# Altium project MyECG.PrjPcb
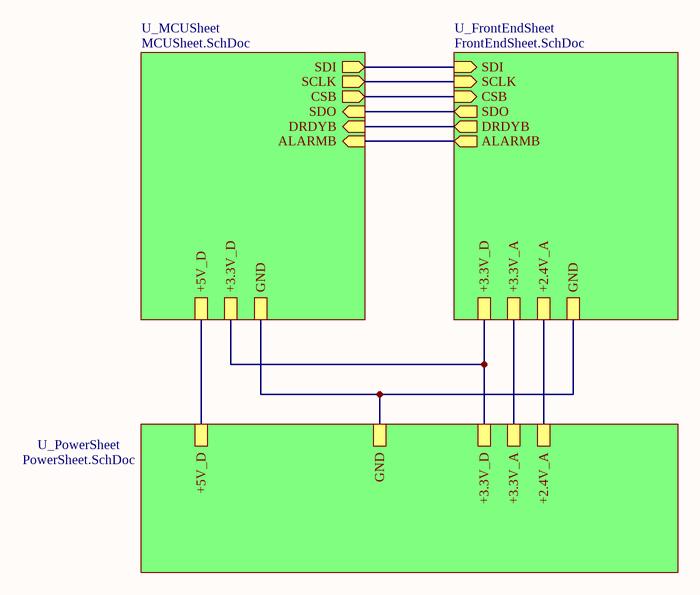
[diagram p0: MyECGSheet.SchDoc]
4 sheets, 152 parts. Net scope: hierarchical (ports join the sheet entries above them; power ports are global).
Board files: MyECGPCB_V1.2.9.PcbDoc, MyECGPCB_V1.2.9.1.PcbDoc
Sheets:
  MyECGSheet.SchDoc
    U_PowerSheet = PowerSheet.SchDoc
    U_FrontEndSheet = FrontEndSheet.SchDoc
    U_MCUSheet = MCUSheet.SchDoc

## Sheet MyECGSheet.SchDoc
size 203 x 152 mm

### Sub-sheets
U_FrontEndSheet = FrontEndSheet.SchDoc: DRDYB (out), SDO (out), SDI (in), SCLK (in), CSB (in), ALARMB (out), +3.3V_D, +3.3V_A, +2.4V_A, GND
U_MCUSheet = MCUSheet.SchDoc: +3.3V_D, GND, SDO (in), SDI (out), SCLK (out), CSB (out), DRDYB (in), ALARMB (in), +5V_D
U_PowerSheet = PowerSheet.SchDoc: GND, +5V_D, +3.3V_D, +3.3V_A, +2.4V_A

### Nets
+2.4V_A: sheet U_PowerSheet/+2.4V_A, sheet U_FrontEndSheet/+2.4V_A
+3.3V_A: sheet U_PowerSheet/+3.3V_A, sheet U_FrontEndSheet/+3.3V_A
+3.3V_D: sheet U_PowerSheet/+3.3V_D, sheet U_FrontEndSheet/+3.3V_D, sheet U_MCUSheet/+3.3V_D
BAT-: sheet U_PowerSheet/GND, sheet U_FrontEndSheet/GND, sheet U_MCUSheet/GND
V+: sheet U_PowerSheet/+5V_D, sheet U_MCUSheet/+5V_D
NetR2_2: sheet U_FrontEndSheet/DRDYB, sheet U_MCUSheet/DRDYB
NetR6_1: sheet U_FrontEndSheet/SDO, sheet U_MCUSheet/SDO
NetR11_1: sheet U_FrontEndSheet/ALARMB, sheet U_MCUSheet/ALARMB
NetT_P9_1: sheet U_FrontEndSheet/SDI, sheet U_MCUSheet/SDI
NetT_P11_1: sheet U_FrontEndSheet/CSB, sheet U_MCUSheet/CSB
NetT_P12_1: sheet U_FrontEndSheet/SCLK, sheet U_MCUSheet/SCLK

## Sheet PowerSheet.SchDoc
size 208 x 152 mm
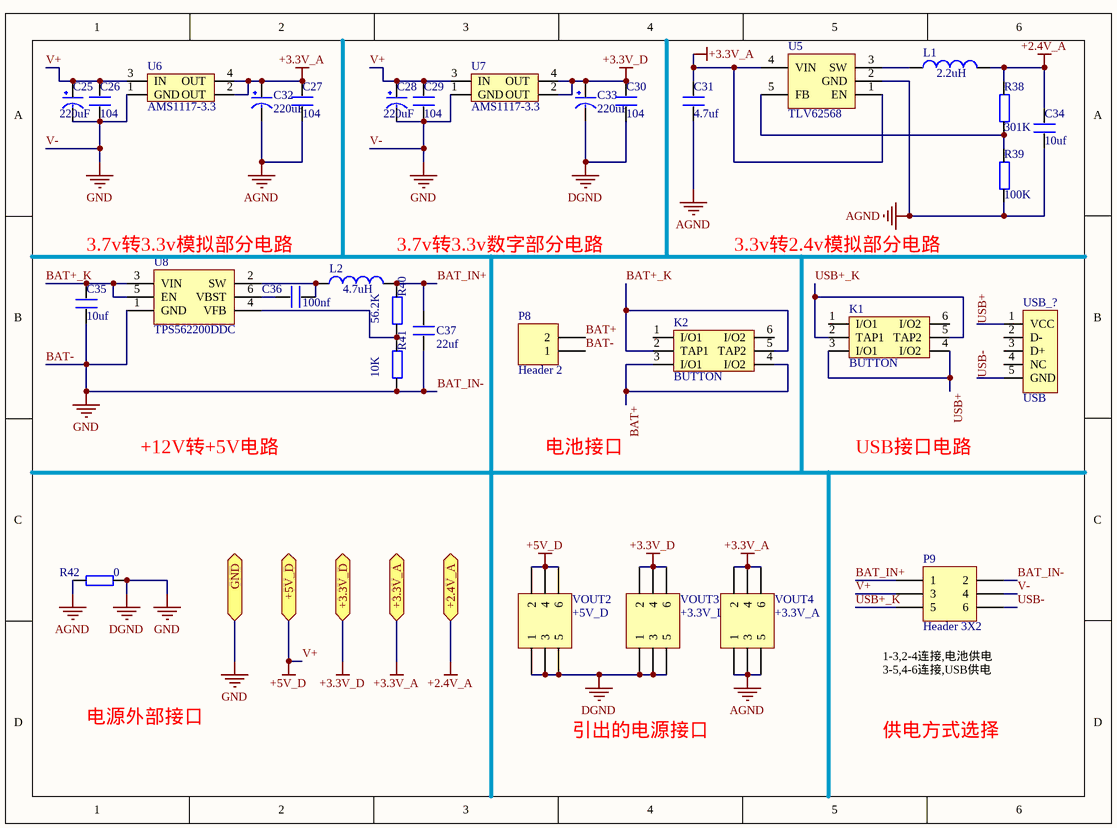
[diagram p1: PowerSheet.SchDoc]

### Parts
C25  220uF  [CC6.56.5]
C26  104  [0805]
C27  104  [0805]
C28  220uF  [CC6.56.5]
C29  104  [0805]
C30  104  [0805]
C31  4.7uf  [0805]
C32  220uF  [CC6.56.5]
C33  220uF  [CC6.56.5]
C34  10uf  [0805]
C35  10uf  [0805]
C36  100nf  [0805]
C37  22uf  [0805]
K1  BUTTON  [BTN8.5*8.5]
K2  BUTTON  [BTN8.5*8.5]
L1  value 2.2uH  [SDR0403]  (hidden comment: Inductor)
L2  value 4.7uH  [SDR0805]  (hidden comment: Inductor)
MINI_USB  USB  [USB/SM0.8-6H5]
P8  Header 2  [HDR1X2]
P9  Header 3X2  [HDR2X3]
R38  301K  [0805]
R39  100K  [0805]
R40  56.2K  [0805]
R41  10K  [0805]
R42  0  [0805]
U5  TLV62568  [LC-SOT-23-5]
U6  AMS1117-3.3  [AMS1117]
U7  AMS1117-3.3  [AMS1117]
U8  TPS562200DDC  [LC-SOT-23-6]
VOUT2  +5V_D  [HDR2X3]
VOUT3  +3.3V_D  [HDR2X3]
VOUT4  +3.3V_A  [HDR2X3]

### Ports
+2.4V_A, +3.3V_A, +3.3V_D, +5V_D, GND

### Nets
+2.4V_A: C34.2 L1.2 R38.2 ; port +2.4V_A
+3.3V_A: C27.2 C31.2 C32.1(VCC) U5.1(EN) U5.4(VIN) U6.2(OUT) U6.4(OUT) VOUT4.2 VOUT4.4 VOUT4.6 ; port +3.3V_A
+3.3V_D: C30.2 C33.1(VCC) U7.2(OUT) U7.4(OUT) VOUT3.2 VOUT3.4 VOUT3.6 ; port +3.3V_D
AGND: C27.1 C31.1 C32.2(GND) C34.1 R39.1 R42.1 U5.2(GND) VOUT4.1 VOUT4.3 VOUT4.5
BAT-: C25.2(GND) C26.1 C28.2(GND) C29.1 C30.1 C33.2(GND) C35.1 C37.2 P8.1 P9.2 P9.4 R41.1 R42.2 U6.1(GND) U7.1(GND) U8.1(GND) VOUT2.1 VOUT2.3 VOUT2.5 VOUT3.1 VOUT3.3 VOUT3.5 ; port GND  [also labelled BAT_IN-, DGND, GND, V-]
V+: C25.1(VCC) C26.2 C28.1(VCC) C29.2 P9.3 U6.3(IN) U7.3(IN) VOUT2.2 VOUT2.4 VOUT2.6 ; port +5V_D  [also labelled +5V_D]
BAT+: K2.3(I/O1) K2.4(I/O2) P8.2
BAT+_K: C35.2 K2.2(TAP1) K2.5(TAP2) U8.3(VIN) U8.5(EN)
BAT_IN+: C37.1 L2.2 P9.1 R40.2
USB+: K1.3(I/O1) K1.4(I/O2) MINI_USB.1(VCC)
USB+_K: K1.2(TAP1) K1.5(TAP2) P9.5
USB-: MINI_USB.5(GND) P9.6
NetC36_1: C36.1 L2.1 U8.2(SW)
NetC36_2: C36.2 U8.6(VBST)
NetL1_1: L1.1 U5.3(SW)
NetR38_1: R38.1 R39.2 U5.5(FB)
NetR40_1: R40.1 R41.2 U8.4(VFB)

Not connected (* = marked no-connect by the designer): K1 1(I/O1) 6(I/O2); K2 1(I/O1) 6(I/O2); MINI_USB 2(D-) 3(D+) 4(NC)

### Notes on the sheet
- 3.7v转3.3v模拟部分电路
- 3.7v转3.3v数字部分电路
- 3.3v转2.4v模拟部分电路
- +12V转+5V电路
- 电池接口
- USB接口电路
- (near P9) 1-3,2-4连接,电池供电
  3-5,4-6连接,USB供电
- 电源外部接口
- 引出的电源接口
- 供电方式选择

### Library data of the parts
C25 C28 C32 C33 = CAP
C26 C27 C29 C30 C35-C37 = C
C31 = C: Cap= 4.7 uF  ESR= 2.0 mOhm  VDC= 25.0 V  IRMS= 7.29 A
C34 = C: Cap= 10.0 uF  ESR= 2.0 mOhm  VDC= 6.3 V  IRMS= 0.0 A
L1 L2 = Inductor: L= 2.2 µH  DCR= 47.0 mOhm; Code_IEC: 1005; Published: 8-Jun-2000; LatestRevisionDate: 29-May-2009; LatestRevisionNote: IPC-7351 Footprint Added.; PackageReference: 0402-A; Publisher: Altium Limited; PackageDescription: Chip Inductor; Code_JEITA: 0402
MINI_USB = USB5
P8 = Header 2: Header, 2-Pin; LatestRevisionDate: 17-Jul-2002; LatestRevisionNote: Re-released for DXP Platform.; Publisher: Altium Limited
P9 VOUT2-VOUT4 = Header 3X2: Header, 3-Pin, Dual row; LatestRevisionDate: 17-Jul-2002; LatestRevisionNote: Re-released for DXP Platform.; Publisher: Altium Limited
R38 R40 R41 = R: Res= 100.0 kOhm  Power= 125.0 mW  Tolerance= 1.0%
R39 = R: Res= 301.0 kOhm  Power= 125.0 mW  Tolerance= 1.0%
R42 = R
U6 U7 = AMS1117

## Sheet FrontEndSheet.SchDoc
size 203 x 152 mm
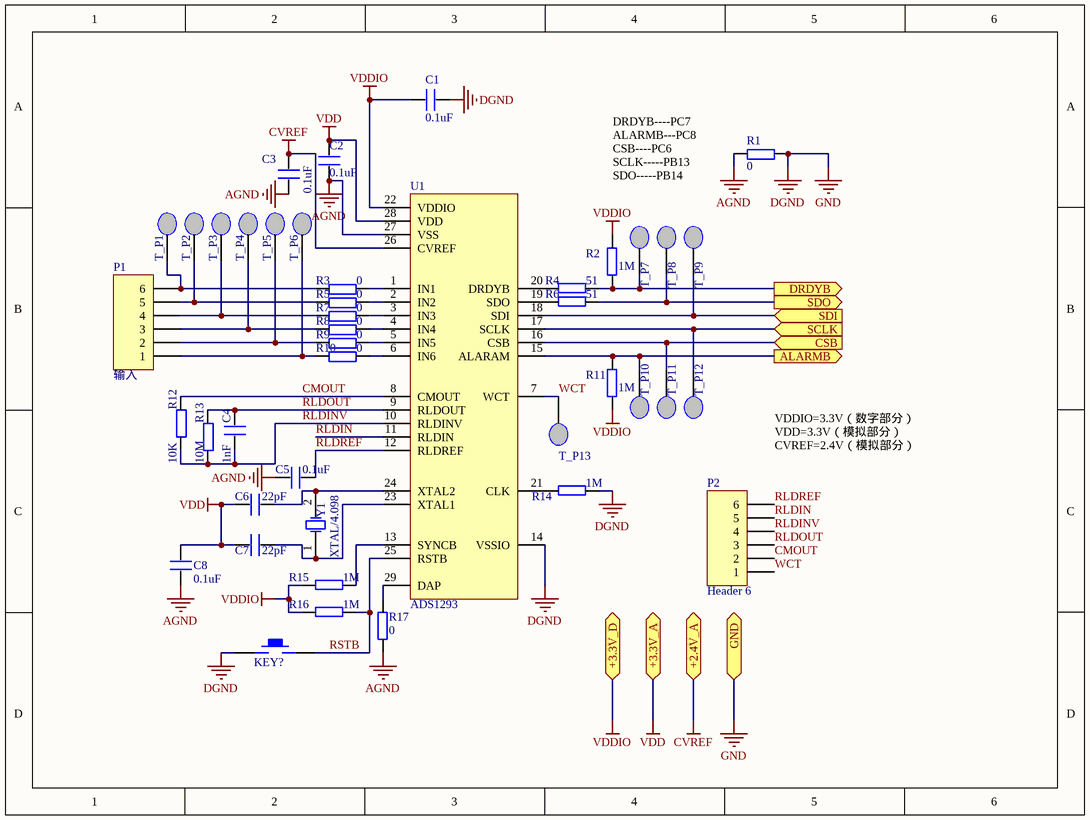
[diagram p2: FrontEndSheet.SchDoc]

### Parts
C1  0.1uF  [0805]
C2  0.1uF  [0805]
C3  0.1uF  [0805]
C4  1nF  [0603]
C5  0.1uF  [0805]
C6  22pF  [0805]
C7  22pF  [0805]
C8  0.1uF  [0805]
KEY_RESET  KEY_M  [KEY_M]  (value not drawn)
P1  输入  [HDR1X6]
P2  Header 6  [HDR1X6]
R1  0  [0805]
R2  1M  [0805]
R3  0  [0805]
R4  51  [0805]
R5  0  [0805]
R6  51  [0805]
R7  0  [0805]
R8  0  [0805]
R9  0  [0805]
R10  0  [0805]
R11  1M  [0805]
R12  10K  [0805]
R13  10M  [0805]
R14  1M  [0805]
R15  1M  [0805]
R16  1M  [0805]
R17  0  [0805]
T_P1  Test_Pad  [PCB_Test_Pad]  (value not drawn)
T_P2  Test_Pad  [PCB_Test_Pad]  (value not drawn)
T_P3  Test_Pad  [PCB_Test_Pad]  (value not drawn)
T_P4  Test_Pad  [PCB_Test_Pad]  (value not drawn)
T_P5  Test_Pad  [PCB_Test_Pad]  (value not drawn)
T_P6  Test_Pad  [PCB_Test_Pad]  (value not drawn)
T_P7  Test_Pad  [PCB_Test_Pad]  (value not drawn)
T_P8  Test_Pad  [PCB_Test_Pad]  (value not drawn)
T_P9  Test_Pad  [PCB_Test_Pad]  (value not drawn)
T_P10  Test_Pad  [PCB_Test_Pad]  (value not drawn)
T_P11  Test_Pad  [PCB_Test_Pad]  (value not drawn)
T_P12  Test_Pad  [PCB_Test_Pad]  (value not drawn)
T_P13  Test_Pad  [PCB_Test_Pad]  (value not drawn)
U1  ADS1293  [SQA28A]
Y1  XTAL/4.098  [XTAL_US]

### Ports
+2.4V_A, +3.3V_A, +3.3V_D, ALARMB (out), CSB (in), DRDYB (out), GND, SCLK (in), SDI (in), SDO (out)

### Nets
AGND: C2.1 C3.1 C5.2 C8.1 R1.1 R17.2 U1.27(VSS)
CVREF: C3.2 U1.26(CVREF) ; port +2.4V_A  [project net +2.4V_A]
DGND: C1.2 KEY_RESET.1 R1.2 R14.1 U1.14(VSSIO) ; port GND  [also labelled GND]  [project net BAT-]
VDD: C2.2 C6.1 C7.1 C8.2 U1.28(VDD) ; port +3.3V_A  [project net +3.3V_A]
VDDIO: C1.1 R2.1 R11.2 R15.2 R16.2 U1.22(VDDIO) ; port +3.3V_D  [project net +3.3V_D]
CMOUT: P2.2 R12.2 U1.8(CMOUT)
RLDIN: P2.5 U1.11(RLDIN)
RLDINV: C4.2 P2.4 R12.1 R13.1 U1.10(RLDINV)
RLDOUT: C4.1 P2.3 R13.2 U1.9(RLDOUT)
RLDREF: C5.1 P2.6 U1.12(RLDREF)
RSTB: KEY_RESET.2 R16.1 U1.25(RSTB)
WCT: P2.1 T_P13.1 U1.7(WCT)
NetC6_2: C6.2 U1.24(XTAL2) Y1.2(OSC2)
NetC7_2: C7.2 U1.23(XTAL1) Y1.1(OSC1)
NetP1_1: P1.1 R10.1 T_P6.1
NetP1_2: P1.2 R9.1 T_P5.1
NetP1_3: P1.3 R8.1 T_P4.1
NetP1_4: P1.4 R7.1 T_P3.1
NetP1_5: P1.5 R5.1 T_P2.1
NetP1_6: P1.6 R3.1 T_P1.1
NetR2_2: R2.2 R4.1 T_P7.1 ; port DRDYB
NetR3_2: R3.2 U1.1(IN1)
NetR4_2: R4.2 U1.20(DRDYB)
NetR5_2: R5.2 U1.2(IN2)
NetR6_1: R6.1 T_P8.1 ; port SDO
NetR6_2: R6.2 U1.19(SDO)
NetR7_2: R7.2 U1.3(IN3)
NetR8_2: R8.2 U1.4(IN4)
NetR9_2: R9.2 U1.5(IN5)
NetR10_2: R10.2 U1.6(IN6)
NetR11_1: R11.1 T_P10.1 U1.15(ALARAM) ; port ALARMB
NetR14_2: R14.2 U1.21(CLK)
NetR15_1: R15.1 U1.13(SYNCB)
NetR17_1: R17.1 U1.29(DAP)
NetT_P9_1: T_P9.1 U1.18(SDI) ; port SDI
NetT_P11_1: T_P11.1 U1.16(CSB) ; port CSB
NetT_P12_1: T_P12.1 U1.17(SCLK) ; port SCLK

### Notes on the sheet
- (near R1) DRDYB----PC7
  ALARMB---PC8
  CSB----PC6
  SCLK-----PB13
  SDO-----PB14
  SDI----PB15
- VDDIO=3.3V（数字部分）
  VDD=3.3V（模拟部分）
  CVREF=2.4V（模拟部分）

### Library data of the parts
C1-C8 = C
P1 P2 = Header 6: Header, 6-Pin; LatestRevisionDate: 17-Jul-2002; LatestRevisionNote: Re-released for DXP Platform.; Publisher: Altium Limited
R1-R17 = R
Y1 = XTAL: Crystal Oscillator; Published: 8-Jun-2000; LatestRevisionDate: 17-Jul-2002; LatestRevisionNote: Re-released for DXP Platform.; PackageReference: R38; Publisher: Altium Limited; PackageDescription: Crystal, Thru-Hole; 2 Leads; Body 3.1 x 8.2 mm (Dia.xH)

## Sheet MCUSheet.SchDoc
size 279 x 254 mm
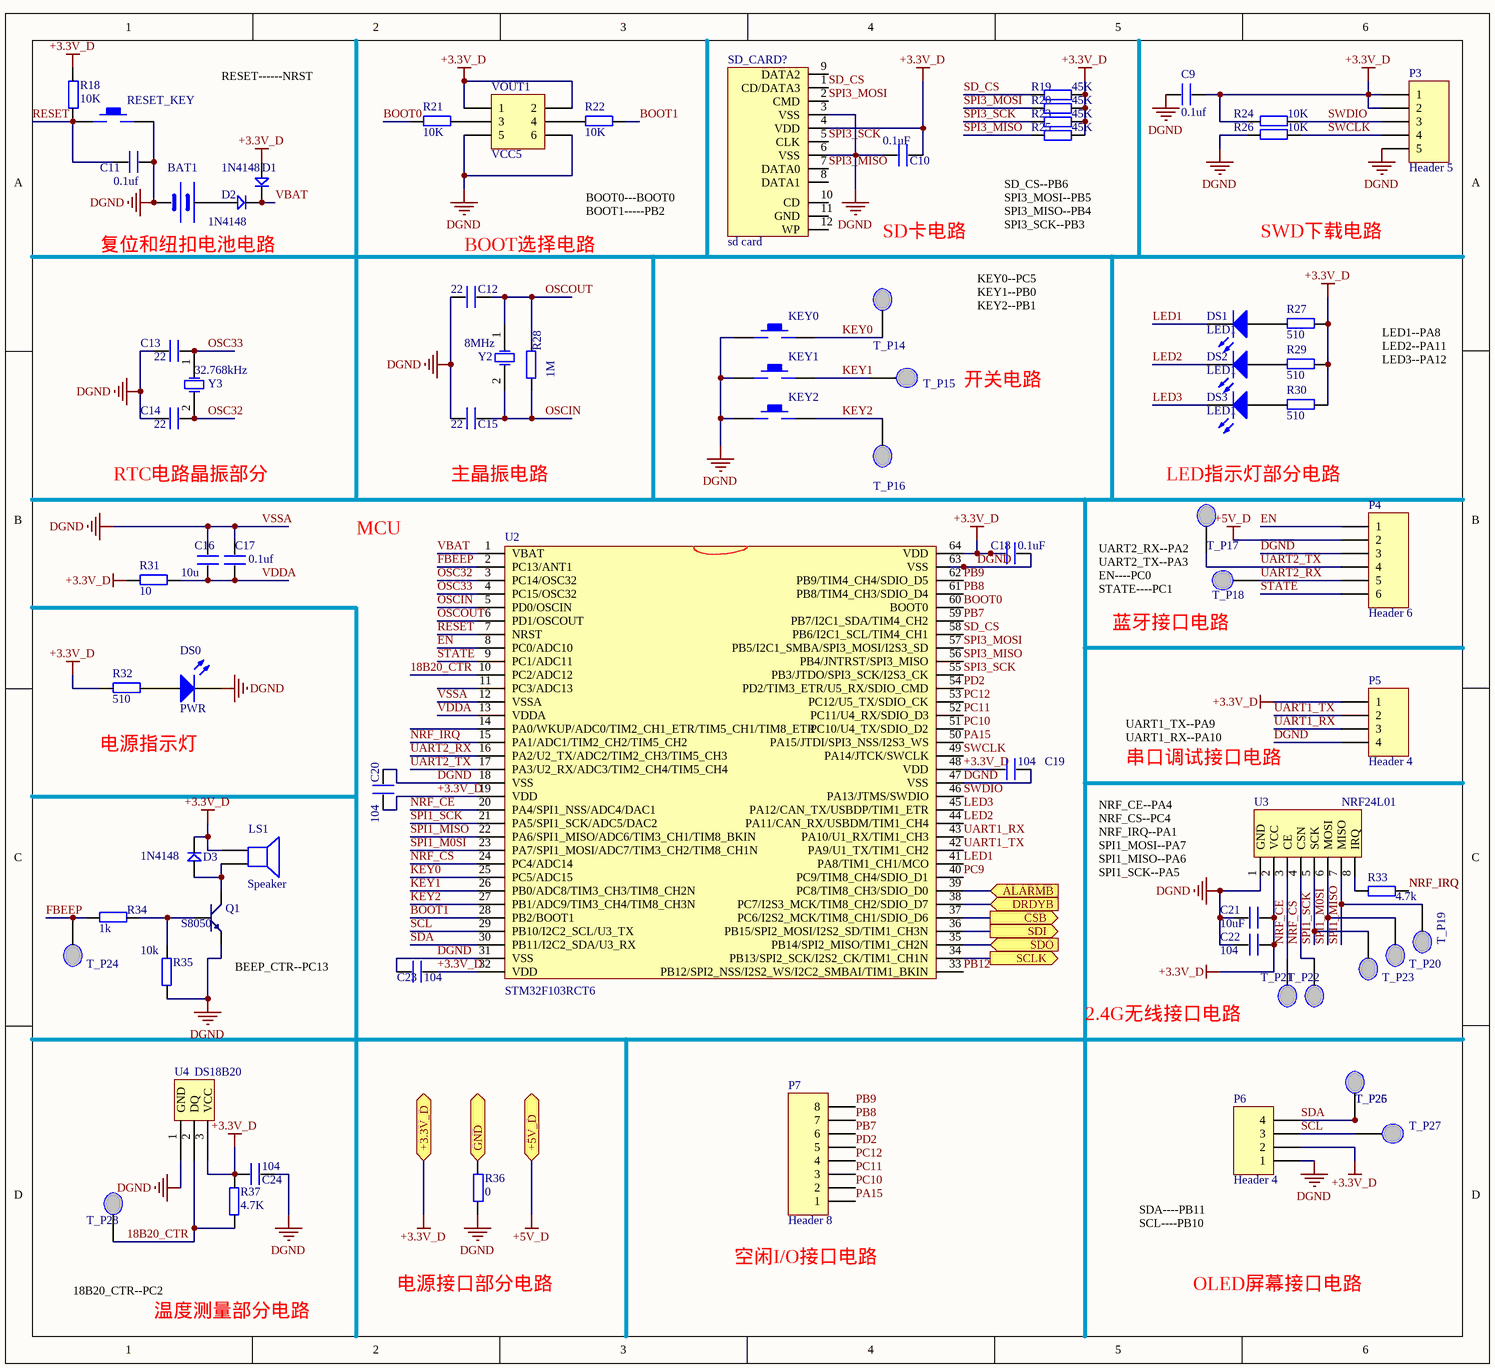
[diagram p3: MCUSheet.SchDoc]

### Parts
BAT1  BATT  [BATM]  (value not drawn)
C9  0.1uf  [0805]
C10  0.1uF  [0805]
C11  0.1uf  [0805]
C12  22  [0805]
C13  22  [0805]
C14  22  [0805]
C15  22  [0805]
C16  10u  [0805]
C17  0.1uf  [0805]
C18  0.1uF  [0805]
C19  104  [0805]
C20  104  [0805]
C21  10uF  [0805]
C22  104  [0805]
C23  104  [0805]
C24  104  [0805]
D1  1N4148  [DIODE_SOP]
D2  1N4148  [DIODE_SOP]
D3  1N4148  [DIODE_SOP]
DS0  PWR  [SMDLED]
DS1  LED1  [SMDLED]
DS2  LED1  [SMDLED]
DS3  LED1  [SMDLED]
KEY0  KEY_M  [KEY_M]  (value not drawn)
KEY1  KEY_M  [KEY_M]  (value not drawn)
KEY2  KEY_M  [KEY_M]  (value not drawn)
LS1  Speaker  [PIN2]
P3  Header 5  [HDR1X5]
P4  Header 6  [HDR1X6]
P5  Header 4  [HDR1X4]
P6  Header 4  [HDR1X4]
P7  Header 8  [HDR1X8]
Q1  S8050  [SOT-23R]
R18  10K  [0805]
R19  45K  [0805]
R20  45K  [0805]
R21  10K  [0805]
R22  10K  [0805]
R23  45K  [0805]
R24  10K  [0805]
R25  45K  [0805]
R26  10K  [0805]
R27  510  [0805]
R28  1M  [0805]
R29  510  [0805]
R30  510  [0805]
R31  10  [0805]
R32  510  [0805]
R33  4.7k  [0805]
R34  1k  [0805]
R35  10k  [0805]
R36  0  [0805]
R37  4.7K  [0805]
RESET_KEY  KEY_M  [KEY_M]  (value not drawn)
SD_CARD  sd card  [SDCARD_L]
T_P14  Test_Pad  [PCB_Test_Pad]  (value not drawn)
T_P15  Test_Pad  [PCB_Test_Pad]  (value not drawn)
T_P16  Test_Pad  [PCB_Test_Pad]  (value not drawn)
T_P17  Test_Pad  [PCB_Test_Pad]  (value not drawn)
T_P18  Test_Pad  [PCB_Test_Pad]  (value not drawn)
T_P19  Test_Pad  [PCB_Test_Pad]  (value not drawn)
T_P20  Test_Pad  [PCB_Test_Pad]  (value not drawn)
T_P21  Test_Pad  [PCB_Test_Pad]  (value not drawn)
T_P22  Test_Pad  [PCB_Test_Pad]  (value not drawn)
T_P23  Test_Pad  [PCB_Test_Pad]  (value not drawn)
T_P24  Test_Pad  [PCB_Test_Pad]  (value not drawn)
T_P25  Test_Pad  [PCB_Test_Pad]  (value not drawn)
T_P26  Test_Pad  [PCB_Test_Pad]  (value not drawn)
T_P27  Test_Pad  [PCB_Test_Pad]  (value not drawn)
T_P28  Test_Pad  [PCB_Test_Pad]  (value not drawn)
U2  STM32F103RCT6  [LQFP64]
U3  NRF24L01  [NRF24L01]
U4  DS18B20  [DS18B20]
VOUT1  VCC5  [HDR2X3]
Y2  8MHz  [XTAL_US]
Y3  32.768kHz  [XTAL32]

### Ports
+3.3V_D, +5V_D, ALARMB (in), CSB (out), DRDYB (in), GND, SCLK (out), SDI (out), SDO (in)

### Nets
+3.3V_D: C9.1 C10.1 C18.1 C19.1 C20.1 C21.2 C22.2 C23.2 C24.2 D1.1 D3.2 LS1.1 P3.1 P3.2 P5.1 P6.2 R18.2 R19.2 R20.2 R23.2 R24.2 R25.2 R27.1 R29.1 R30.1 R31.2 R32.2 R37.1 SD_CARD.4(VDD) U2.19(VDD) U2.32(VDD) U2.48(VDD) U2.64(VDD) U3.2(VCC) U4.3(VCC) VOUT1.1 VOUT1.2 ; port +3.3V_D
+5V_D: P4.2 ; port +5V_D  [project net V+]
DGND: BAT1.2(GND) C9.2 C10.2 C11.2 C12.1 C13.1 C14.1 C15.1 C16.2 C17.2 C18.2 C19.2 C20.2 C21.1 C22.1 C23.1 C24.1 DS0.2(K) KEY0.1 KEY1.1 KEY2.1 P3.5 P4.3 P5.4 P6.1 Q1.1(E) R26.2 R35.2 R36.1 R36.2 RESET_KEY.2 SD_CARD.3(VSS) SD_CARD.6(VSS) U2.12(VSSA) U2.18(VSS) U2.31(VSS) U2.47(VSS) U2.63(VSS) U3.1(GND) U4.1(GND) VOUT1.5 VOUT1.6 ; port GND  [also labelled VSSA]  [project net BAT-]
18B20_CTR: R37.2 T_P28.1 U2.10(PC2/ADC12) U4.2(DQ)
BOOT0: R21.2 U2.60(BOOT0)
BOOT1: R22.1 U2.28(PB2/BOOT1)
EN: P4.1 U2.8(PC0/ADC10)
FBEEP: R34.2 T_P24.1 U2.2(PC13/ANT1)
KEY0: KEY0.2 T_P14.1 U2.25(PC5/ADC15)
KEY1: KEY1.2 T_P15.1 U2.26(PB0/ADC8/TIM3_CH3/TIM8_CH2N)
KEY2: KEY2.2 T_P16.1 U2.27(PB1/ADC9/TIM3_CH4/TIM8_CH3N)
LED1: DS1.2(K) U2.41(PA8/TIM1_CH1/MCO)
LED2: DS2.2(K) U2.44(PA11/CAN_RX/USBDM/TIM1_CH4)
LED3: DS3.2(K) U2.45(PA12/CAN_TX/USBDP/TIM1_ETR)
NRF_CE: T_P21.1 U2.20(PA4/SPI1_NSS/ADC4/DAC1) U3.3(CE)
NRF_CS: T_P22.1 U2.24(PC4/ADC14) U3.4(CSN)
NRF_IRQ: R33.2 U2.15(PA1/ADC1/TIM2_CH2/TIM5_CH2)
OSC32: C14.2 U2.3(PC14/OSC32) Y3.2(OSC2)
OSC33: C13.2 U2.4(PC15/OSC32) Y3.1(OSC1)
OSCIN: C15.2 R28.2 U2.5(PD0/OSCIN) Y2.2(OSC2)
OSCOUT: C12.2 R28.1 U2.6(PD1/OSCOUT) Y2.1(OSC1)
PA15: P7.1 U2.50(PA15/JTDI/SPI3_NSS/I2S3_WS)
PB7: P7.6 U2.59(PB7/I2C1_SDA/TIM4_CH2)
PB8: P7.7 U2.61(PB8/TIM4_CH3/SDIO_D4)
PB9: P7.8 U2.62(PB9/TIM4_CH4/SDIO_D5)
PB12: U2.33(PB12/SPI2_NSS/I2S2_WS/I2C2_SMBAI/TIM1_BKIN)
PC9: U2.40(PC9/TIM8_CH4/SDIO_D1)
PC10: P7.2 U2.51(PC10/U4_TX/SDIO_D2)
PC11: P7.3 U2.52(PC11/U4_RX/SDIO_D3)
PC12: P7.4 U2.53(PC12/U5_TX/SDIO_CK)
PD2: P7.5 U2.54(PD2/TIM3_ETR/U5_RX/SDIO_CMD)
RESET: C11.1 R18.1 RESET_KEY.1 U2.7(NRST)
SCL: P6.3 T_P27.1 U2.29(PB10/I2C2_SCL/U3_TX)
SD_CS: R19.1 SD_CARD.1(CD/DATA3) U2.58(PB6/I2C1_SCL/TIM4_CH1)
SDA: P6.4 T_P25.1 T_P26.1 U2.30(PB11/I2C2_SDA/U3_RX)
SPI1_M0SI: T_P20.1 U2.23(PA7/SPI1_MOSI/ADC7/TIM3_CH2/TIM8_CH1N) U3.6(MOSI)
SPI1_MISO: T_P19.1 U2.22(PA6/SPI1_MISO/ADC6/TIM3_CH1/TIM8_BKIN) U3.7(MISO)
SPI1_SCK: T_P23.1 U2.21(PA5/SPI1_SCK/ADC5/DAC2) U3.5(SCK)
SPI3_MISO: R25.1 SD_CARD.7(DATA0) U2.56(PB4/JNTRST/SPI3_MISO)
SPI3_MOSI: R20.1 SD_CARD.2(CMD) U2.57(PB5/I2C1_SMBA/SPI3_MOSI/I2S3_SD)
SPI3_SCK: R23.1 SD_CARD.5(CLK) U2.55(PB3/JTDO/SPI3_SCK/I2S3_CK)
STATE: P4.6 U2.9(PC1/ADC11)
SWCLK: P3.4 R26.1 U2.49(PA14/JTCK/SWCLK)
SWDIO: P3.3 R24.1 U2.46(PA13/JTMS/SWDIO)
UART1_RX: P5.3 U2.43(PA10/U1_RX/TIM1_CH3)
UART1_TX: P5.2 U2.42(PA9/U1_TX/TIM1_CH2)
UART2_RX: P4.5 T_P18.1 U2.16(PA2/U2_TX/ADC2/TIM2_CH3/TIM5_CH3)
UART2_TX: P4.4 T_P17.1 U2.17(PA3/U2_RX/ADC3/TIM2_CH4/TIM5_CH4)
VBAT: D1.2 D2.2 U2.1(VBAT)
VDDA: C16.1 C17.1 R31.1 U2.13(VDDA)
NetBAT1_1: BAT1.1(VCC) D2.1
NetD3_1: D3.1 LS1.2 Q1.3(C)
NetDS0_1: DS0.1(A) R32.1
NetDS1_1: DS1.1(A) R27.2
NetDS2_1: DS2.1(A) R29.2
NetDS3_1: DS3.1(A) R30.2
NetQ1_2: Q1.2(B) R34.1 R35.1
NetR2_2: U2.38(PC7/I2S3_MCK/TIM8_CH2/SDIO_D7) ; port DRDYB
NetR6_1: U2.35(PB14/SPI2_MISO/TIM1_CH2N) ; port SDO
NetR11_1: U2.39(PC8/TIM8_CH3/SDIO_D0) ; port ALARMB
NetR21_1: R21.1 VOUT1.3
NetR22_2: R22.2 VOUT1.4
NetR33_1: R33.1 U3.8(IRQ)
NetT_P9_1: U2.36(PB15/SPI2_MOSI/I2S2_SD/TIM1_CH3N) ; port SDI
NetT_P11_1: U2.37(PC6/I2S2_MCK/TIM8_CH1/SDIO_D6) ; port CSB
NetT_P12_1: U2.34(PB13/SPI2_SCK/I2S2_CK/TIM1_CH1N) ; port SCLK

Not connected (* = marked no-connect by the designer): SD_CARD 8(DATA1) 9(DATA2) 10(CD) 11(GND) 12(WP); U2 11(PC3/ADC13) 14(PA0/WKUP/ADC0/TIM2_CH1_ETR/TIM5_CH1/TIM8_ETR)

### Notes on the sheet
- RESET------NRST
- BOOT0---BOOT0
  BOOT1-----PB2
- SD卡电路
- SD_CS--PB6
  SPI3_MOSI--PB5
  SPI3_MISO--PB4
  SPI3_SCK--PB3
- SWD下载电路
- (near BAT1) 复位和纽扣电池电路
- (near C12) BOOT选择电路
- KEY0--PC5
  KEY1--PB0
  KEY2--PB1
- LED1--PA8
  LED2--PA11
  LED3--PA12
- 开关电路
- RTC电路晶振部分
- 主晶振电路
- LED指示灯部分电路
- MCU
- (near T_P17) UART2_RX--PA2
  UART2_TX--PA3
  EN----PC0
  STATE----PC1
- 蓝牙接口电路
- 电源指示灯
- 串口调试接口电路
- UART1_TX--PA9
  UART1_RX--PA10
- NRF_CE--PA4
  NRF_CS--PC4
  NRF_IRQ--PA1
  SPI1_MOSI--PA7
  SPI1_MISO--PA6
  SPI1_SCK--PA5
- (near Q1) BEEP_CTR--PC13
- 2.4G无线接口电路
- SDA----PB11
  SCL----PB10
- 18B20_CTR--PC2
- 温度测量部分电路
- 电源接口部分电路
- (near P7) 空闲I/O接口电路
- OLED屏幕接口电路

### Library data of the parts
BAT1 = BAT
C9-C24 = C
D1-D3 = D
DS0-DS3 = LED2: Typical RED, GREEN, YELLOW, AMBER GaAs LED; Published: 8-Jun-2000; LatestRevisionDate: 17-Jul-2002; LatestRevisionNote: Re-released for DXP Platform.; PackageDocument: Feb-2002; PackageReference: 3.2X1.6X1.1; Publisher: Altium Limited
LS1 = Speaker: Loudspeaker; Published: 24-Mar-1999; LatestRevisionDate: 17-Jul-2002; LatestRevisionNote: Re-released for DXP Platform.; PackageReference: PIN2; Publisher: Altium Limited
P3 = Header 5: Header, 5-Pin; LatestRevisionDate: 17-Jul-2002; LatestRevisionNote: Re-released for DXP Platform.; Publisher: Altium Limited
P4 = Header 6: Header, 6-Pin; LatestRevisionDate: 17-Jul-2002; LatestRevisionNote: Re-released for DXP Platform.; Publisher: Altium Limited
P5 P6 = Header 4: Header, 4-Pin; LatestRevisionDate: 17-Jul-2002; LatestRevisionNote: Re-released for DXP Platform.; Publisher: Altium Limited
P7 = Header 8: Header, 8-Pin; LatestRevisionDate: 17-Jul-2002; LatestRevisionNote: Re-released for DXP Platform.; Publisher: Altium Limited
Q1 = NPN: 8050/BCW846/BCW847
R18-R37 = R
U2 = STM32F103RDT6
VOUT1 = Header 3X2: Header, 3-Pin, Dual row; LatestRevisionDate: 17-Jul-2002; LatestRevisionNote: Re-released for DXP Platform.; Publisher: Altium Limited
Y2 Y3 = XTAL: Crystal Oscillator; Published: 8-Jun-2000; LatestRevisionDate: 17-Jul-2002; LatestRevisionNote: Re-released for DXP Platform.; Publisher: Altium Limited

## Nets that join several sheets
+2.4V_A: PowerSheet (C34.2 L1.2 R38.2), FrontEndSheet (C3.2 U1.26)
+3.3V_A: PowerSheet (10 pins), FrontEndSheet (5 pins)
+3.3V_D: PowerSheet (7 pins), FrontEndSheet (6 pins), MCUSheet (37 pins)
AGND: PowerSheet (10 pins), FrontEndSheet (7 pins)
BAT-: PowerSheet (22 pins), FrontEndSheet (5 pins), MCUSheet (42 pins)
V+: PowerSheet (10 pins), MCUSheet (P4.2)
NetR2_2: FrontEndSheet (R2.2 R4.1 T_P7.1), MCUSheet (U2.38)
NetR6_1: FrontEndSheet (R6.1 T_P8.1), MCUSheet (U2.35)
NetR11_1: FrontEndSheet (R11.1 T_P10.1 U1.15), MCUSheet (U2.39)
NetT_P9_1: FrontEndSheet (T_P9.1 U1.18), MCUSheet (U2.36)
NetT_P11_1: FrontEndSheet (T_P11.1 U1.16), MCUSheet (U2.37)
NetT_P12_1: FrontEndSheet (T_P12.1 U1.17), MCUSheet (U2.34)